# Altium schematic sheet Pedal_SW.SchDoc
size A4; SheetNumber: 1; SheetTotal: 1
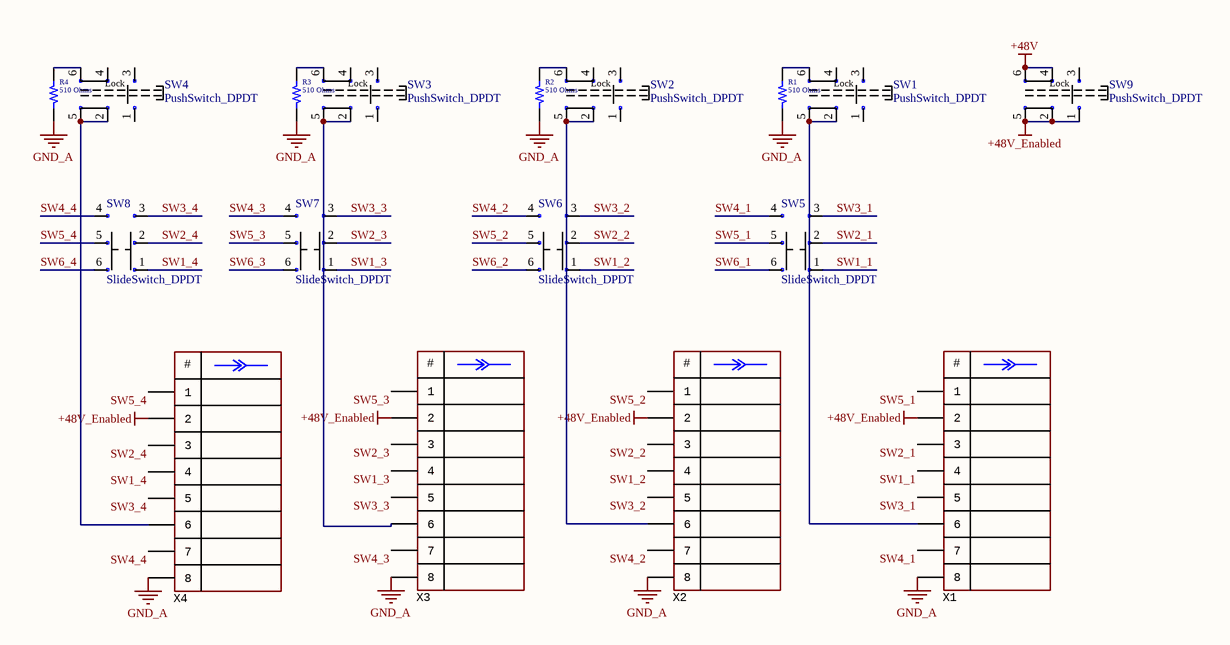
[diagram p0: Pedal_SW.SchDoc]

## Parts
R1  510 Ohms  [YAGEO RES 0603_1608]
R2  510 Ohms  [YAGEO RES 0603_1608]
R3  510 Ohms  [YAGEO RES 0603_1608]
R4  510 Ohms  [YAGEO RES 0603_1608]
SW1  PushSwitch_DPDT  [TK-6580A-1]
SW2  PushSwitch_DPDT  [TK-6580A-1]
SW3  PushSwitch_DPDT  [TK-6580A-1]
SW4  PushSwitch_DPDT  [TK-6580A-1]
SW5  SlideSwitch_DPDT  [SK-22F03-G060]
SW6  SlideSwitch_DPDT  [SK-22F03-G060]
SW7  SlideSwitch_DPDT  [SK-22F03-G060]
SW8  SlideSwitch_DPDT  [SK-22F03-G060]
SW9  PushSwitch_DPDT  [TK-6580A-1]
X1  (no value)  [CON: PBD-8]
X2  (no value)  [CON: PBD-8]
X3  (no value)  [CON: PBD-8]
X4  (no value)  [CON: PBD-8]

## Nets
+48V: SW9.4 SW9.6
+48V_Enabled: SW9.1 SW9.2 SW9.5 X1.2 X2.2 X3.2 X4.2
GND_A: R1.2 R2.2 R3.2 R4.2 X1.8 X2.8 X3.8 X4.8
SW1_1: SW5.1 X1.4
SW1_2: SW6.1 X2.4
SW1_3: SW7.1 X3.4
SW1_4: SW8.1 X4.4
SW2_1: SW5.2 X1.3
SW2_2: SW6.2 X2.3
SW2_3: SW7.2 X3.3
SW2_4: SW8.2 X4.3
SW3_1: SW5.3 X1.5
SW3_2: SW6.3 X2.5
SW3_3: SW7.3 X3.5
SW3_4: SW8.3 X4.5
SW4_1: SW5.4 X1.7
SW4_2: SW6.4 X2.7
SW4_3: SW7.4 X3.7
SW4_4: SW8.4 X4.7
SW5_1: SW5.5 X1.1
SW5_2: SW6.5 X2.1
SW5_3: SW7.5 X3.1
SW5_4: SW8.5 X4.1
SW6_1: SW5.6
SW6_2: SW6.6
SW6_3: SW7.6
SW6_4: SW8.6
NetR1_1: R1.1 SW1.6
NetR2_1: R2.1 SW2.6
NetR3_1: R3.1 SW3.6
NetR4_1: R4.1 SW4.6
NetSW1_2: SW1.2 SW1.5 X1.6
NetSW2_2: SW2.2 SW2.5 X2.6
NetSW3_2: SW3.2 SW3.5 X3.6
NetSW4_2: SW4.2 SW4.5 X4.6

Not connected (* = marked no-connect by the designer): SW1 1 3 4; SW2 1 3 4; SW3 1 3 4; SW4 1 3 4; SW9 3

## Notes on the sheet
- (in symbol PBD-8) #
- (in symbol PushSwitch_DPDT) Lock

## Library data of the parts
R1-R4 = AC0603FR-07510RL: RES SMD 510 OHM 1% 1/10W 0603; Manufacturer: Yageo; Power (Watts): 0.1W, 1/10W; Temperature Coefficient: ±100ppm/°C; Part Number: AC0603FR-07510RL; Value: 510 Ohms; ComponentLink1Description: Datasheet; ComponentLink1URL: https://www.yageo.com/upload/media/product/productsearch/datasheet/rchip/PYu-AC_51_RoHS_L_7.pdf; ComponentLink2Description: DigiKey Link; ComponentLink2URL: https://www.digikey.com/en/products/detail/yageo/AC0603FR-07510RL/5896175; Composition: Thick Film; Device Package: 0603 (1608 Metric); Features: Automotive AEC-Q200, Moisture Resistant; Height - Seated (Max): 0.022" (0.55mm); LastUpdated: 7/25/2024 9:19:25 AM; Lifecycle Status: Active; Minimum Order: 1; Number of Terminations: 2; Operating Temperature: -55°C ~ 155°C; Package / Case: 0603 (1608 Metric); Packaging: CutTape; PartId: 15979; Part Status: Active; Price: 0.01; Ratings: AEC-Q200; Resistance: 510 Ohms; Series: AC; Size / Dimension: 0.063" L x 0.031" W (1.60mm x 0.80mm); Supplier 1: DigiKey; Supplier Part Number 1: YAG3615CT-ND; Supplier Device Package: 0603; Tolerance: ±1%
X1-X4 = PBD-8: Manufacturer: Connfly; ValueManufacturerPartNumber: Connector, 8pin, 2.54mm, 500VAC, 3A; TypeConnector: Connector; VoltageMax: 500VAC; Pitch: 2.54mm; CurrentMax: 3A; Multichannel: 8pin; CommentText: "Разъем"; HelpURL: https://www.chipdip.ru/product/pbd-8; PartNumber: PBD-8